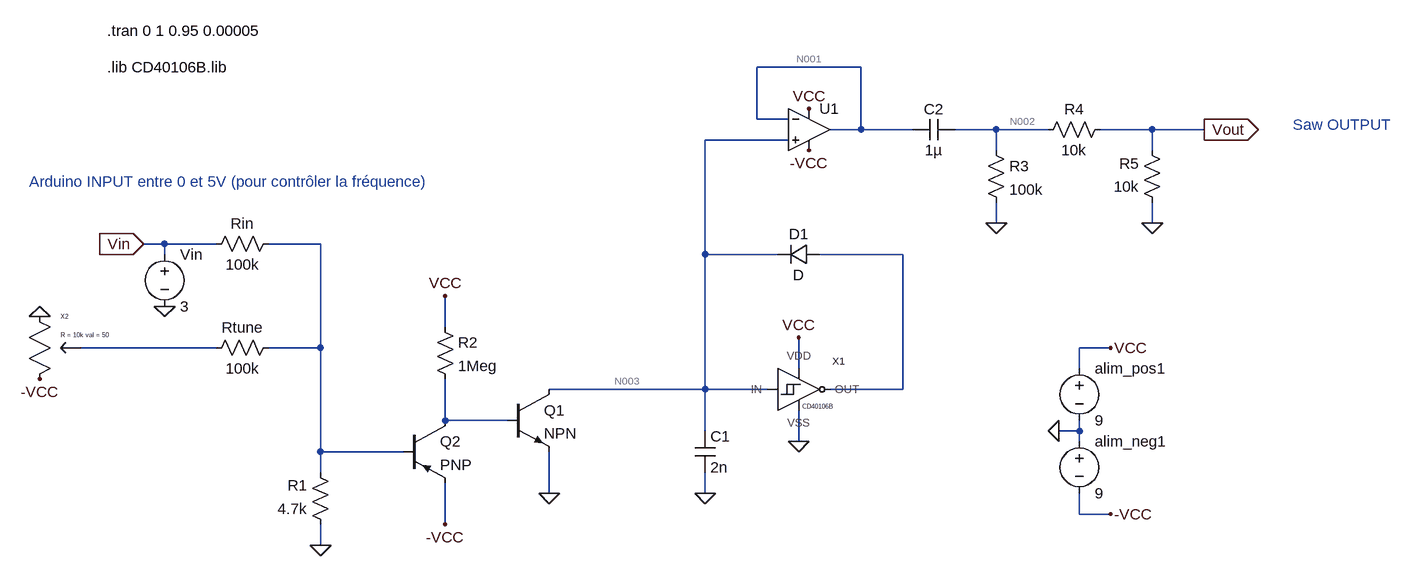
[diagram p0: schematic saw_generator.asc]
saw_generator.asc, the LTspice schematic file:
Version 4.1
SHEET 1 1632 680
WIRE 64 -672 -96 -672
WIRE -96 -592 -96 -672
WIRE -48 -592 -96 -592
WIRE 64 -576 64 -672
WIRE 64 -576 16 -576
WIRE 144 -576 64 -576
WIRE 272 -576 208 -576
WIRE 352 -576 272 -576
WIRE 512 -576 432 -576
WIRE 592 -576 512 -576
WIRE -48 -560 -176 -560
WIRE 272 -544 272 -576
WIRE 512 -544 512 -576
WIRE 272 -432 272 -464
WIRE 512 -432 512 -464
WIRE -1008 -400 -1040 -400
WIRE -928 -400 -1008 -400
WIRE -768 -400 -848 -400
WIRE -1008 -384 -1008 -400
WIRE -176 -384 -176 -560
WIRE -64 -384 -176 -384
WIRE 128 -384 0 -384
WIRE -576 -272 -576 -320
WIRE -928 -240 -1136 -240
WIRE -768 -240 -768 -400
WIRE -768 -240 -848 -240
WIRE 448 -240 400 -240
WIRE -32 -208 -32 -256
WIRE 400 -208 400 -240
WIRE -176 -176 -176 -384
WIRE -176 -176 -416 -176
WIRE -80 -176 -176 -176
WIRE 128 -176 128 -384
WIRE 128 -176 16 -176
WIRE -576 -128 -576 -192
WIRE -480 -128 -576 -128
WIRE -176 -112 -176 -176
WIRE 400 -112 400 -128
WIRE 400 -112 368 -112
WIRE -32 -96 -32 -144
WIRE 400 -96 400 -112
WIRE -768 -80 -768 -240
WIRE -640 -80 -768 -80
WIRE -768 -48 -768 -80
WIRE -416 -16 -416 -80
WIRE -176 -16 -176 -48
WIRE 400 16 400 -16
WIRE 448 16 400 16
WIRE -576 32 -576 -32
WIRE -768 64 -768 32
FLAG 592 -576 Vout
IOPIN 592 -576 Out
FLAG -32 -96 0
FLAG 368 -112 0
FLAG 448 -240 VCC
FLAG 448 16 -VCC
FLAG -16 -544 -VCC
FLAG -16 -608 VCC
FLAG -32 -256 VCC
FLAG -176 -16 0
FLAG -416 -16 0
FLAG -576 -320 VCC
FLAG -576 32 -VCC
FLAG -768 64 0
FLAG -1008 -304 0
FLAG -1200 -288 0
FLAG -1200 -192 -VCC
FLAG 512 -432 0
FLAG 272 -432 0
FLAG -1040 -400 Vin
IOPIN -1040 -400 In
SYMBOL res -752 48 R180
WINDOW 0 36 76 Left 2
WINDOW 3 36 40 Left 2
SYMATTR InstName R1
SYMATTR Value 4.7k
SYMBOL OpAmps\\UniversalOpAmp -16 -576 R0
SYMATTR InstName U1
SYMBOL CD40106B -32 -176 R0
WINDOW 3 6 26 Left 0
SYMATTR InstName X1
SYMBOL voltage 400 -224 R0
SYMATTR InstName alim_pos1
SYMATTR Value 9
SYMBOL voltage 400 -112 R0
SYMATTR InstName alim_neg1
SYMATTR Value 9
SYMBOL diode 0 -400 R90
WINDOW 0 0 32 VBottom 2
WINDOW 3 32 32 VTop 2
SYMATTR InstName D1
SYMBOL cap -192 -112 R0
SYMATTR InstName C1
SYMATTR Value 2n
SYMBOL cap 144 -560 R270
WINDOW 0 32 32 VTop 2
WINDOW 3 0 32 VBottom 2
SYMATTR InstName C2
SYMATTR Value 1µ
SYMBOL res -592 -288 R0
SYMATTR InstName R2
SYMATTR Value 1Meg
SYMBOL res 256 -560 R0
SYMATTR InstName R3
SYMATTR Value 100k
SYMBOL res 448 -592 R90
WINDOW 0 0 56 VBottom 2
WINDOW 3 32 56 VTop 2
SYMATTR InstName R4
SYMATTR Value 10k
SYMBOL res 528 -448 R180
WINDOW 0 36 76 Left 2
WINDOW 3 36 40 Left 2
SYMATTR InstName R5
SYMATTR Value 10k
SYMBOL npn -480 -176 R0
SYMATTR InstName Q1
SYMBOL pnp -640 -128 R0
SYMATTR InstName Q2
SYMBOL res -832 -416 R90
WINDOW 0 0 56 VBottom 2
WINDOW 3 32 56 VTop 2
SYMATTR InstName Rin
SYMATTR Value 100k
SYMBOL res -832 -256 R90
WINDOW 0 0 56 VBottom 2
WINDOW 3 32 56 VTop 2
SYMATTR InstName Rtune
SYMATTR Value 100k
SYMBOL voltage -1008 -400 R0
WINDOW 123 0 0 Left 0
WINDOW 39 0 0 Left 0
SYMATTR InstName Vin
SYMATTR Value 3
SYMBOL pot -1232 -272 R0
WINDOW 39 64 12 Left 0
SYMATTR SpiceLine R = 10k val = 50
SYMATTR InstName X2
TEXT -1096 -672 Left 2 !.lib CD40106B.lib
TEXT -1216 -496 Left 2 ;Arduino INPUT entre 0 et 5V (pour contrôler la fréquence)
TEXT 728 -584 Left 2 ;Saw OUTPUT
TEXT -1096 -728 Left 2 !.tran 0 1 0.95 0.00005

The netlist it stands for:
* saw_generator.asc
R1 0 N004 4.7k
X§U1 N003 N001 VCC -VCC N001 level1 Avol=1Meg GBW=10Meg Vos=0 En=0 Enk=0 In=0 Ink=0 Rin=500Meg  ; pins In+ In- V+ V- OUT
X§X1 N005 N003 VCC 0 CD40106B CD40106B  ; pins OUT IN VDD VSS
V§alim_pos1 VCC 0 9
V§alim_neg1 0 -VCC 9
D1 N005 N003 D
C1 N003 0 2n
C2 N001 N002 1µ
R2 VCC N007 1Meg
R3 N002 0 100k
R4 Vout N002 10k
R5 0 Vout 10k
Q1 N003 N007 0 0 NPN
Q2 N007 N004 -VCC 0 PNP
Rin N004 Vin 100k
Rtune N004 N006 100k
Vin Vin 0 3
X§X2 0 N006 -VCC pot R = 10k val = 50  ; pins 1 2 3
.model D D
.lib standard.dio
.model NPN NPN
.model PNP PNP
.lib standard.bjt
.lib CD40106B.lib
* Arduino INPUT entre 0 et 5V (pour contrôler la fréquence)
* Saw OUTPUT
.tran 0 1 0.95 0.00005
.lib UniversalOpAmp1.lib
.backanno
.end

* Results of the author's LTspice run, read from the files saved beside the schematic
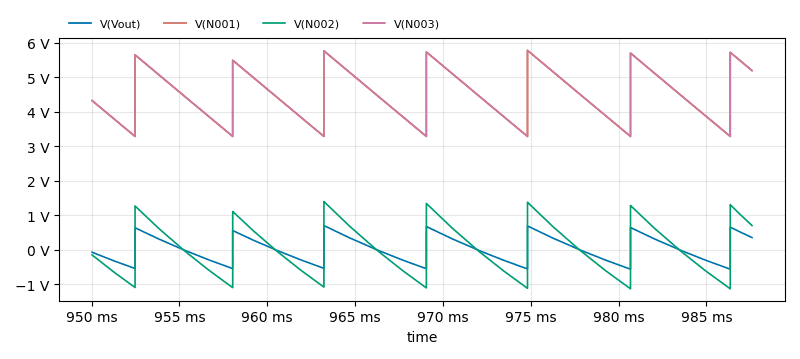
[diagram p1: Transient Analysis of saw_generator.asc, plotted from the saved traces]
* Transient Analysis, 1 run:
*   V(Vout): min -568.6 mV, max 696 mV, average 5.785 mV, rms 373.1 mV, last 348.3 mV
*   V(N001): min 3.28 V, max 5.774 V, average 4.468 V, rms 4.53 V, last 5.187 V
*   V(N002): min -1.137 V, max 1.392 V, average 11.57 mV, rms 746.2 mV, last 696.6 mV
*   V(N003): min 3.28 V, max 5.773 V, average 4.468 V, rms 4.53 V, last 5.187 V